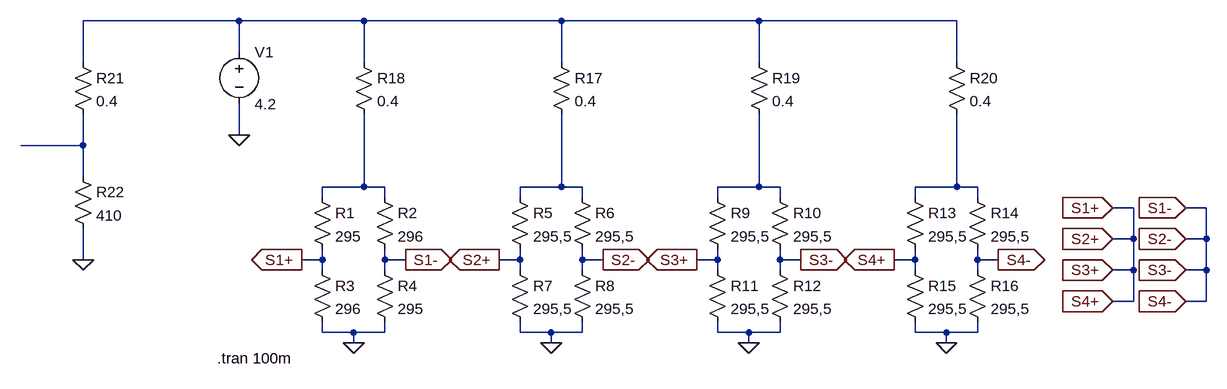
[diagram p0: schematic Draft1.asc]
Draft1.asc, the LTspice schematic file:
Version 4
SHEET 1 1348 700
WIRE -208 16 -448 16
WIRE -16 16 -208 16
WIRE 288 16 -16 16
WIRE 592 16 288 16
WIRE 896 16 592 16
WIRE -208 64 -208 16
WIRE -448 80 -448 16
WIRE -16 80 -16 16
WIRE 288 80 288 16
WIRE 592 80 592 16
WIRE 896 80 896 16
WIRE -208 192 -208 144
WIRE -448 208 -448 160
WIRE -448 208 -544 208
WIRE -448 256 -448 208
WIRE -16 272 -16 160
WIRE -16 272 -80 272
WIRE 16 272 -16 272
WIRE 288 272 288 160
WIRE 288 272 224 272
WIRE 320 272 288 272
WIRE 592 272 592 160
WIRE 592 272 528 272
WIRE 624 272 592 272
WIRE 896 272 896 160
WIRE 896 272 832 272
WIRE 928 272 896 272
WIRE -80 288 -80 272
WIRE 16 288 16 272
WIRE 224 288 224 272
WIRE 320 288 320 272
WIRE 528 288 528 272
WIRE 624 288 624 272
WIRE 832 288 832 272
WIRE 928 288 928 272
WIRE 1168 304 1136 304
WIRE 1280 304 1248 304
WIRE 1168 352 1168 304
WIRE 1168 352 1136 352
WIRE 1280 352 1280 304
WIRE 1280 352 1248 352
WIRE -448 384 -448 336
WIRE -80 384 -80 368
WIRE -80 384 -112 384
WIRE 16 384 16 368
WIRE 48 384 16 384
WIRE 224 384 224 368
WIRE 224 384 192 384
WIRE 320 384 320 368
WIRE 352 384 320 384
WIRE 528 384 528 368
WIRE 528 384 496 384
WIRE 624 384 624 368
WIRE 656 384 624 384
WIRE 832 384 832 368
WIRE 832 384 800 384
WIRE 928 384 928 368
WIRE 960 384 928 384
WIRE -80 400 -80 384
WIRE 16 400 16 384
WIRE 224 400 224 384
WIRE 320 400 320 384
WIRE 528 400 528 384
WIRE 624 400 624 384
WIRE 832 400 832 384
WIRE 928 400 928 384
WIRE 1168 400 1168 352
WIRE 1168 400 1136 400
WIRE 1280 400 1280 352
WIRE 1280 400 1248 400
WIRE 1168 448 1168 400
WIRE 1168 448 1136 448
WIRE 1280 448 1280 400
WIRE 1280 448 1248 448
WIRE -80 496 -80 480
WIRE -32 496 -80 496
WIRE 16 496 16 480
WIRE 16 496 -32 496
WIRE 224 496 224 480
WIRE 272 496 224 496
WIRE 320 496 320 480
WIRE 320 496 272 496
WIRE 528 496 528 480
WIRE 576 496 528 496
WIRE 624 496 624 480
WIRE 624 496 576 496
WIRE 832 496 832 480
WIRE 880 496 832 496
WIRE 928 496 928 480
WIRE 928 496 880 496
WIRE -32 512 -32 496
WIRE 272 512 272 496
WIRE 576 512 576 496
WIRE 880 512 880 496
FLAG -208 192 0
FLAG -32 512 0
FLAG 272 512 0
FLAG 576 512 0
FLAG 880 512 0
FLAG -112 384 S1+
IOPIN -112 384 Out
FLAG 48 384 S1-
IOPIN 48 384 Out
FLAG 192 384 S2+
IOPIN 192 384 Out
FLAG 352 384 S2-
IOPIN 352 384 Out
FLAG 496 384 S3+
IOPIN 496 384 Out
FLAG 656 384 S3-
IOPIN 656 384 Out
FLAG 800 384 S4+
IOPIN 800 384 Out
FLAG 960 384 S4-
IOPIN 960 384 Out
FLAG 1136 304 S1+
IOPIN 1136 304 In
FLAG 1136 352 S2+
IOPIN 1136 352 In
FLAG 1136 400 S3+
IOPIN 1136 400 In
FLAG 1136 448 S4+
IOPIN 1136 448 In
FLAG -448 384 0
FLAG 1248 304 S1-
IOPIN 1248 304 In
FLAG 1248 448 S4-
IOPIN 1248 448 In
FLAG 1248 352 S2-
IOPIN 1248 352 In
FLAG 1248 400 S3-
IOPIN 1248 400 In
DATAFLAG 832 272 ""
DATAFLAG 528 272 ""
DATAFLAG 224 272 ""
DATAFLAG -80 272 ""
DATAFLAG -544 208 ""
SYMBOL res -96 272 R0
SYMATTR InstName R1
SYMATTR Value 295
SYMBOL res 0 272 R0
SYMATTR InstName R2
SYMATTR Value 296
SYMBOL res -96 384 R0
SYMATTR InstName R3
SYMATTR Value 296
SYMBOL res 0 384 R0
SYMATTR InstName R4
SYMATTR Value 295
SYMBOL voltage -208 48 R0
WINDOW 123 0 0 Left 2
WINDOW 39 24 124 Left 2
SYMATTR InstName V1
SYMATTR Value 4.2
SYMBOL res 208 272 R0
SYMATTR InstName R5
SYMATTR Value 295,5
SYMBOL res 304 272 R0
SYMATTR InstName R6
SYMATTR Value 295,5
SYMBOL res 208 384 R0
SYMATTR InstName R7
SYMATTR Value 295,5
SYMBOL res 304 384 R0
SYMATTR InstName R8
SYMATTR Value 295,5
SYMBOL res 512 272 R0
SYMATTR InstName R9
SYMATTR Value 295,5
SYMBOL res 608 272 R0
SYMATTR InstName R10
SYMATTR Value 295,5
SYMBOL res 512 384 R0
SYMATTR InstName R11
SYMATTR Value 295,5
SYMBOL res 608 384 R0
SYMATTR InstName R12
SYMATTR Value 295,5
SYMBOL res 816 272 R0
SYMATTR InstName R13
SYMATTR Value 295,5
SYMBOL res 912 272 R0
SYMATTR InstName R14
SYMATTR Value 295,5
SYMBOL res 816 384 R0
SYMATTR InstName R15
SYMATTR Value 295,5
SYMBOL res 912 384 R0
SYMATTR InstName R16
SYMATTR Value 295,5
SYMBOL res 272 64 R0
SYMATTR InstName R17
SYMATTR Value 0.4
SYMBOL res -32 64 R0
SYMATTR InstName R18
SYMATTR Value 0.4
SYMBOL res 576 64 R0
SYMATTR InstName R19
SYMATTR Value 0.4
SYMBOL res 880 64 R0
SYMATTR InstName R20
SYMATTR Value 0.4
SYMBOL res -464 64 R0
SYMATTR InstName R21
SYMATTR Value 0.4
SYMBOL res -464 240 R0
SYMATTR InstName R22
SYMATTR Value 410
TEXT -242 536 Left 2 !.tran 100m

The netlist it stands for:
* Draft1.asc
R1 N003 S4+ 295
R2 N003 S4- 296
R3 S4+ 0 296
R4 S4- 0 295
V1 N001 0 4.2
R5 N004 S4+ 295,5
R6 N004 S4- 295,5
R7 S4+ 0 295,5
R8 S4- 0 295,5
R9 N005 S4+ 295,5
R10 N005 S4- 295,5
R11 S4+ 0 295,5
R12 S4- 0 295,5
R13 N006 S4+ 295,5
R14 N006 S4- 295,5
R15 S4+ 0 295,5
R16 S4- 0 295,5
R17 N001 N004 0.4
R18 N001 N003 0.4
R19 N001 N005 0.4
R20 N001 N006 0.4
R21 N001 N002 0.4
R22 N002 0 410
.tran 100m
.backanno
.end